# Altium schematic sheet DAC.SchDoc: AI ARTIQ Driver
size 420 x 297 mm; Author: G.Kasprowicz; CompanyName: CTI; Organization: CTI; Address1: CTI; Address2: Nowowiejska 15/19 00-665 Warsaw; Address3: gkasprow@gmail.com; DocumentNumber: 3; Revision: 1.0; SheetNumber: 3; SheetTotal: 11; ModifiedBy: -; CheckedDate: -; Title2: DAC; DivGrp: CTI; ModifiedDate: -; ProjectName: Sensor Box
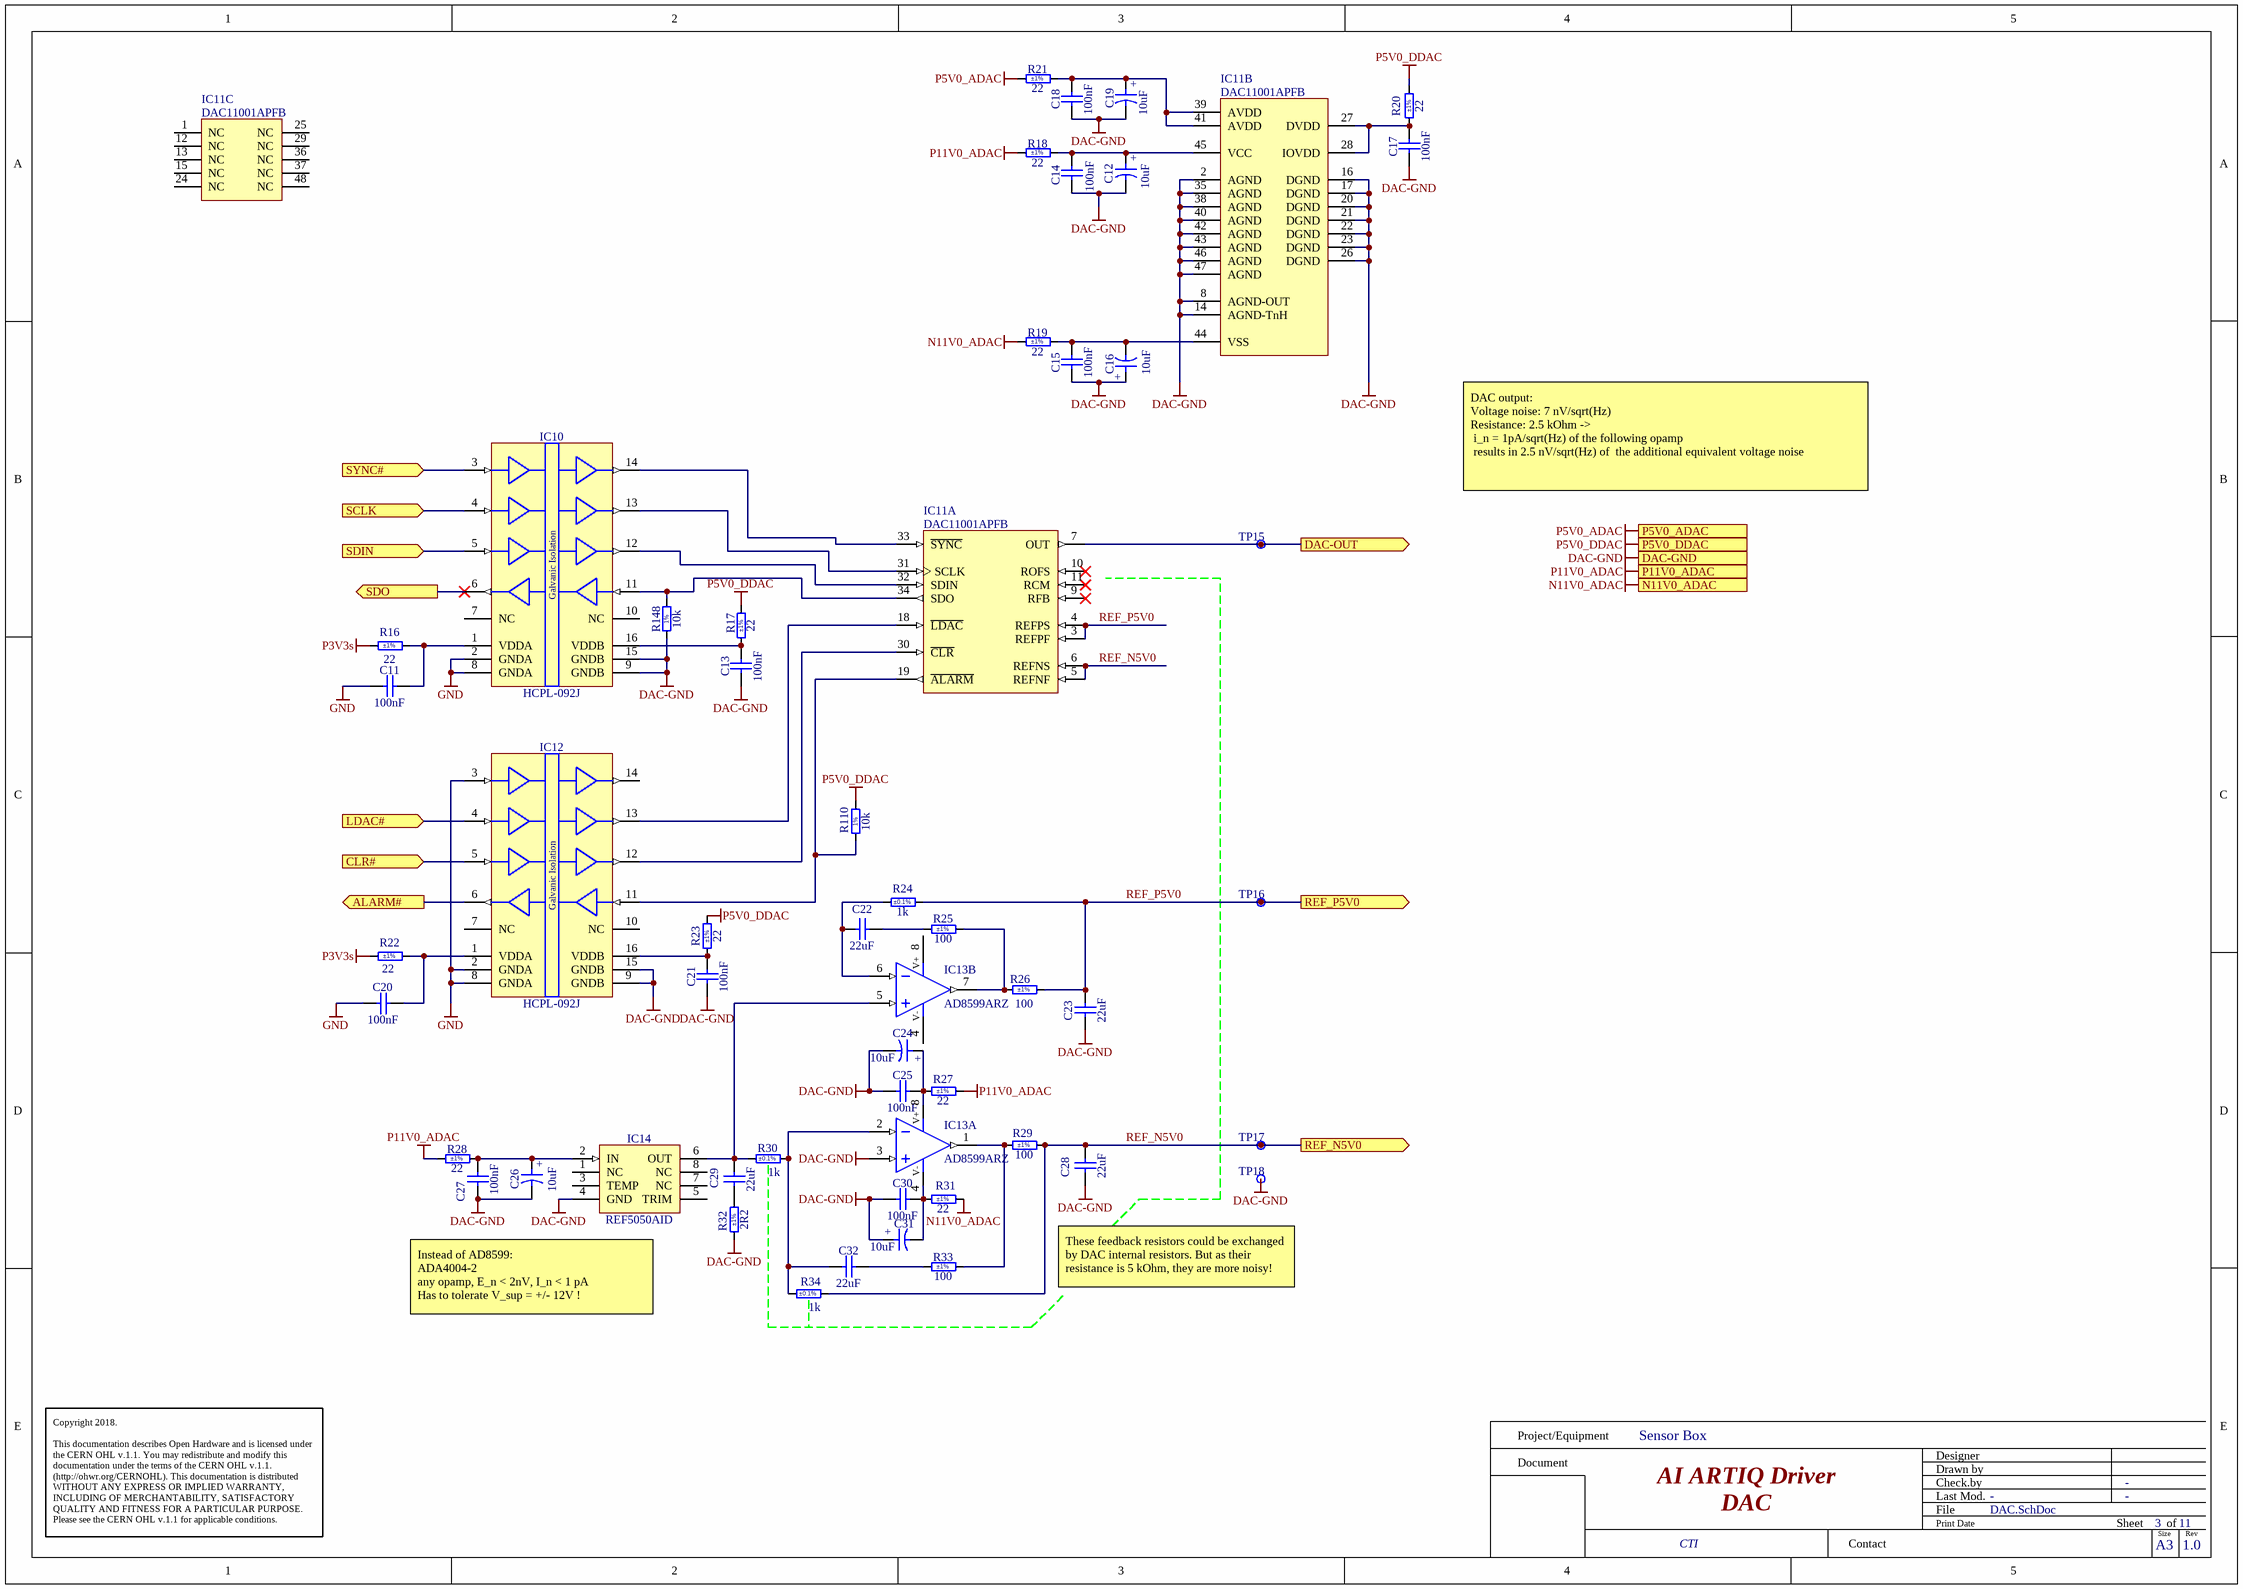
[diagram p0: DAC.SchDoc]

## Parts
C11  100nF  [CAPC1608X87N]
C12  10uF  [CAPMP3528X210N]
C13  100nF  [CAPC1608X87N]
C14  100nF  [CAPC1005X55N]
C15  100nF  [CAPC1005X55N]
C16  10uF  [CAPMP3528X210N]
C17  100nF  [CAPC1005X55N]
C18  100nF  [CAPC1005X55N]
C19  10uF  [CAPMP3528X210N]
C20  100nF  [CAPC1608X87N]
C21  100nF  [CAPC1608X87N]
C22  22uF  [CAPC2012X135N]
C23  22uF  [CAPC2012X135N]
C24  10uF  [CAPMP3528X210N]
C25  100nF  [CAPC1608X87N]
C26  10uF  [CAPMP3528X210N]
C27  100nF  [CAPC1608X87N]
C28  22uF  [CAPC2012X135N]
C29  22uF  [CAPC2012X135N]
C30  100nF  [CAPC1608X87N]
C31  10uF  [CAPMP3528X210N]
C32  22uF  [CAPC2012X135N]
IC10  HCPL-092J  [HCPL-092J]
IC11  DAC11001APFB  [QFP50P900X900X120-48N]  (parts A,B,C of 3)
IC12  HCPL-092J  [HCPL-092J]
IC13  AD8599ARZ  [SOIC127P600X175-8N]  (parts A,B of 2)
IC14  REF5050AID  [SOIC127P600X175-8N]
R16  22  Tolerance: ±1%  [RESC1608X55N]
R17  22  Tolerance: ±1%  [RESC1608X55N]
R18  22  Tolerance: ±1%  [RESC1608X55N]
R19  22  Tolerance: ±1%  [RESC1608X55N]
R20  22  Tolerance: ±1%  [RESC1608X55N]
R21  22  Tolerance: ±1%  [RESC1608X55N]
R22  22  Tolerance: ±1%  [RESC1608X55N]
R23  22  Tolerance: ±1%  [RESC1608X55N]
R24  1k  Tolerance: ±0.1%  [RESC1608X64N]
R25  100  Tolerance: ±1%  [RESC1608X55N]
R26  100  Tolerance: ±1%  [RESC1608X55N]
R27  22  Tolerance: ±1%  [RESC1608X55N]
R28  22  Tolerance: ±1%  [RESC1608X55N]
R29  100  Tolerance: ±1%  [RESC1608X55N]
R30  1k  Tolerance: ±0.1%  [RESC1608X64N]
R31  22  Tolerance: ±1%  [RESC1608X55N]
R32  2R2  Tolerance: ±1%  [RESC1608X55N]
R33  100  Tolerance: ±1%  [RESC1608X55N]
R34  1k  Tolerance: ±0.1%  [RESC1608X64N]
R110  10k  [RESC1608X55N]
R148  10k  [RESC1608X55N]
TP15  Test Point  [TPS127]  (value not drawn)  (no BOM)
TP16  Test Point  [TPS127]  (value not drawn)  (no BOM)
TP17  Test Point  [TPS127]  (value not drawn)  (no BOM)
TP18  Test Point  [TPS127]  (value not drawn)  (no BOM)

## Ports
ALARM# (out), CLR# (in), DAC-GND, DAC-OUT (out), LDAC# (in), N11V0_ADAC, P5V0_ADAC, P5V0_DDAC, P11V0_ADAC, REF_N5V0 (out), REF_P5V0 (out), SCLK (in), SDIN (in), SDO (out), SYNC# (in)

## Nets
DAC-GND: C12.2 C13.1 C14.2 C15.1 C16.1 C17.1 C18.1 C19.2 C21.1 C23.1 C24.2 C25.1 C26.2 C27.1 C28.1 C30.1 C31.1 IC10.9(GNDB) IC10.15(GNDB) IC11.2(AGND) IC11.8(AGND-OUT) IC11.14(AGND-TnH) IC11.16(DGND) IC11.17(DGND) IC11.20(DGND) IC11.21(DGND) IC11.22(DGND) IC11.23(DGND) IC11.26(DGND) IC11.35(AGND) IC11.38(AGND) IC11.40(AGND) IC11.42(AGND) IC11.43(AGND) IC11.46(AGND) IC11.47(AGND) IC12.9(GNDB) IC12.15(GNDB) IC13.3(IN+) IC14.4(GND) R32.1 R148.1 TP18.1 ; port DAC-GND
GND: C11.1 C20.1 IC10.2(GNDA) IC10.8(GNDA) IC12.2(GNDA) IC12.3(IN1) IC12.8(GNDA)
N11V0_ADAC: R19.1 R31.2 ; port N11V0_ADAC
P3V3s: R16.2 R22.2
P5V0_ADAC: R21.1 ; port P5V0_ADAC
P5V0_DDAC: R17.2 R20.2 R23.2 R110.2 ; port P5V0_DDAC
P11V0_ADAC: R18.1 R27.2 R28.1 ; port P11V0_ADAC
ALARM#: IC12.6(IN4) ; port ALARM#
CLR#: IC12.5(IN3) ; port CLR#
DAC-OUT: IC11.7(OUT) TP15.1 ; port DAC-OUT
LDAC#: IC12.4(IN2) ; port LDAC#
REF_N5V0: C28.2 IC11.5(REFNF) IC11.6(REFNS) R29.2 R34.2 TP17.1 ; port REF_N5V0
REF_P5V0: C23.2 IC11.3(REFPF) IC11.4(REFPS) R24.2 R26.2 TP16.1 ; port REF_P5V0
SCLK: IC10.4(IN2) ; port SCLK
SDIN: IC10.5(IN3) ; port SDIN
SDO: IC10.6(IN4) ; port SDO
SYNC#: IC10.3(IN1) ; port SYNC#
NetC11_2: C11.2 IC10.1(VDDA) R16.1
NetC12_1: C12.1 C14.1 IC11.45(VCC) R18.2
NetC13_2: C13.2 IC10.16(VDDB) R17.1
NetC15_2: C15.2 C16.2 IC11.44(VSS) R19.2
NetC17_2: C17.2 IC11.27(DVDD) IC11.28(IOVDD) R20.1
NetC18_2: C18.2 C19.1 IC11.39(AVDD) IC11.41(AVDD) R21.2
NetC20_2: C20.2 IC12.1(VDDA) R22.1
NetC21_2: C21.2 IC12.16(VDDB) R23.1
NetC22_1: C22.1 IC13.6(IN-) R24.1
NetC22_2: C22.2 R25.1
NetC24_1: C24.1 C25.2 IC13.8(V+) R27.1
NetC26_1: C26.1 C27.2 IC14.2(IN) R28.2
NetC29_1: C29.1 R32.2
NetC29_2: C29.2 IC13.5(IN+) IC14.6(OUT) R30.1
NetC30_2: C30.2 C31.2 IC13.4(V-) R31.1
NetC32_1: C32.1 IC13.2(IN-) R30.2 R34.1
NetC32_2: C32.2 R33.1
NetIC10_11: IC10.11(OUT4) IC11.34(SDO) R148.2
NetIC10_12: IC10.12(OUT3) IC11.32(SDIN)
NetIC10_13: IC10.13(OUT2) IC11.31(SCLK)
NetIC10_14: IC10.14(OUT1) IC11.33(~{SYNC})
NetIC11_18: IC11.18(~{LDAC}) IC12.13(OUT2)
NetIC11_19: IC11.19(~{ALARM}) IC12.11(OUT4) R110.1
NetIC11_30: IC11.30(~{CLR}) IC12.12(OUT3)
NetIC13_1: IC13.1(OUT) R29.1 R33.2
NetIC13_7: IC13.7(OUT) R25.2 R26.1

Not connected (* = marked no-connect by the designer): IC10 7(NC) 10(NC); IC11 1(NC) 9(RFB)* 10(ROFS)* 11(RCM)* 12(NC) 13(NC) 15(NC) 24(NC) 25(NC) 29(NC) 36(NC) 37(NC) 48(NC); IC12 7(NC) 10(NC) 14(OUT1); IC14 1(NC) 3(TEMP) 5(TRIM) 7(NC) 8(NC)

## Notes on the sheet
- DAC output:
  Voltage noise: 7 nV/sqrt(Hz)
  Resistance: 2.5 kOhm ->
  i_n = 1pA/sqrt(Hz) of the following opamp
  results in 2.5 nV/sqrt(Hz) of  the additional equivalent voltage noise
- Instead of AD8599:
  ADA4004-2
  any opamp, E_n < 2nV, I_n < 1 pA
  Has to tolerate V_sup = +/- 12V !
- These feedback resistors could be exchanged by DAC internal resistors. But as their resistance is 5 kOhm, they are more noisy!
- Project/Equipment
- Document
- Designer
- Drawn by
- Check.by
- Copyright 2018.
  This documentation describes Open Hardware and is licensed under the CERN OHL v.1.1. You may redistribute and modify this documentation under the terms of the CERN OHL v.1.1. (http://ohwr.org/CERNOHL). This documentation is distributed WITHOUT ANY EXPRESS OR IMPLIED WARRANTY, INCLUDING OF MERCHANTABILITY, SATISFACTORY QUALITY AND FITNESS FOR A PARTICULAR PURPOSE. Please see the CERN OHL v.1.1 for applicable conditions.
- Contact
- File
- Last Mod.
- Print Date
- Sheet
- Size
- A3
- of
- Rev
- (in symbol CTE3528-21_10UF_20V_10%_AVX_TPSB106K020T0500) +
- (in symbol HCPL-092J) Galvanic Isolation
- (in symbol R0603_10K_1%_0.1W_100PPM) 1%

## Library data of the parts
C11 C13 C20 C21 C25 C27 C30 = CC0603_100NF_50V_10%_X7R: Non-polarised capacitor; Part Description: SMD Multilayer Chip Ceramic Capacitor; Manufacturer: GENERIC; Manufacturer1 Part Number: 223858615649; Voltage: 50V; TC: X7R; Tolerance: ±10%; Part Number: CC0603_100NF_50V_10%_X7R; Component Kind: Standard; Component Type: Standard; Pin Count: 2; Value: 100nF; Status: Preferred; Manufacturer Part Number: CC0603_100NF_50V_10%_X7R; Case: 0603; Mounted: Yes; Socket: No; SMD: Yes; Sense: No; Manufacturer1 Example: PHYCOMP; Manufacturer1 ComponentHeight: 0.87mm; HelpURL: \\cern.ch\dfs\Applications\Altium\Datasheets\CC0603_X7R_PHYCOMP.pdf; Author: CERN DEM JLC; CreateDate: 03.12.2007; LatestRevisionDate: 03.12.2007
C12 C16 C19 C24 C26 C31 = CTE3528-21_10UF_20V_10%_AVX_TPSB106K020T0500: Polarised capacitor; Part Description: Low ESR 0R5 Automotive Solid Tantalum Chip Capacitor; Manufacturer: AVX; Voltage: 20V; Tolerance: ±10%; Part Number: CTE3528-21_10UF_20V_10%_AVX_TPSB106K020T0500; Component Kind: Standard; Component Type: Standard; Pin Count: 2; Value: 10uF; Status: Not Recommended; Manufacturer Part Number: TPSB106K020T0500; Case: B; Mounted: Yes; Socket: No; SMD: Yes; Sense: No; ComponentHeight: 2.1mm; HelpURL: \\cern.ch\dfs\Applications\Altium\Datasheets\CTE-LESR_AVX_TPS-AUTO.pdf; Author: CERN DEM JLC; CreateDate: 10.05.2017; LatestRevisionDate: 10.05.2017
C14 C15 C17 C18 = CC0402_100NF_50V_10%_X7R: Non-polarised capacitor; Part Description: SMD Multilayer Chip Ceramic Capacitor; Manufacturer: GENERIC; Manufacturer1 Part Number: GRM155R71H104KE14D; Voltage: 50V; TC: X7R; Tolerance: ±10%; Part Number: CC0402_100NF_50V_10%_X7R; Component Kind: Standard; Component Type: Standard; Pin Count: 2; Value: 100nF; Status: None; Manufacturer Part Number: CC0402_100NF_50V_10%_X7R; Case: 0402; Mounted: Yes; Socket: No; SMD: Yes; Sense: No; Manufacturer1 Example: MURATA; Manufacturer1 ComponentHeight: 0.55mm; HelpURL: \\cern.ch\dfs\Applications\Altium\Datasheets\CC0402_MURATA_GRM155R71H104KE14D.pdf; Author: CERN DEM MR; CreateDate: 30.06.2017; LatestRevisionDate: 30.06.2017
C22 C23 C28 C29 C32 = CC0805_22UF_16V_10%_X5R: Non-polarised capacitor; Part Description: SMD Multilayer Chip Ceramic Capacitor; Manufacturer: GENERIC; Manufacturer1 Part Number: C2012X5R1C226KT; Voltage: 16V; TC: X5R; Tolerance: ±10%; Part Number: CC0805_22UF_16V_10%_X5R; Component Kind: Standard; Component Type: Standard; Pin Count: 2; Value: 22uF; Status: Preferred; Manufacturer Part Number: CC0805_22UF_16V_10%_X5R; Case: 0805; Mounted: Yes; Socket: No; SMD: Yes; Sense: No; Manufacturer1 Example: TDK; Manufacturer1 ComponentHeight: 1.35mm; HelpURL: \\cern.ch\dfs\Applications\Altium\Datasheets\CC0805_X5R_TDK_C.pdf; Author: CERN DEM JLC; CreateDate: 25.10.2012; LatestRevisionDate: 25.10.2012
IC10 IC12 = HCPL-092J: High Speed Digital Isolators Quad, 1/3, Bidirectional; Part Description: 1/3 Channel, Bidirectional, High Speed Digital Isolators Quad; Manufacturer: BROADCOM; PressFit: No; Bonding: No; Part Number: HCPL-092J; Component Kind: Standard; Component Type: Standard; Device: HCPL-092J; Footprint: BROADCOM_HCPL-09X; PackageDescription: SOIC, 1.27mm Pitch; 16 Pin, 9.9mm W X 4.90mm L X 1.8mm H body; Manufacturer Part Number: HCPL-092J; Pin Count: 16; Case: SOIC16; Mounted: Yes; Socket: No; SMD: Yes; Sense: No; ComponentHeight: 1.8mm; Author: CERN DEM HF; HelpURL: \\cern.ch\dfs\Applications\Altium\Datasheets\HCPL-092J.pdf; CreateDate: 23.03.2022; LatestRevisionDate: 23.03.2022
IC11 = DAC11001APFB: 20 Bit, Low-Noise, Ultra-Low Harmonic Distortion, FastSettling, High-Voltage Output, Digital-to-Analog Converter; Manufacturer: TEXAS INSTRUMENTS; PressFit: No; Bonding: No; Part Number: DAC11001APFB; Component Kind: Standard; Component Type: Standard; Device: DAC11001APFB; PackageDescription: QFP, 0.50mm Pitch, Square, 48 Pin, 7.00mm L X 7.00mm W X 1.20mm H body, IPC Medium Density; Part Description: 20 Bit, Low-Noise, Ultra-Low Harmonic Distortion, FastSettling, High-Voltage Output, Digital-to-Analog Converter; Manufacturer Part Number: DAC11001APFB; Pin Count: 48; Case: QFP48; Mounted: Yes; Socket: No; SMD: Yes; Sense: No; ComponentHeight: 1.2mm; Author: CERN DEM HF; HelpURL: \\cern.ch\dfs\Applications\Altium\Datasheets\DAC11001APFB.pdf; CreateDate: 17.05.2022; LatestRevisionDate: 17.05.2022
IC13 = AD8599ARZ: Dual Operational Amplifier; Part Description: Dual, Ultralow Distorsion, Ultralow Noise Operational Amplifier; Manufacturer: ANALOG DEVICES; PressFit: No; Bonding: No; Part Number: AD8599ARZ; Component Kind: Standard; Component Type: Standard; Device: AD8599ARZ; PackageDescription: SOIC, 1.27mm Pitch; 8 Pin, 4.00mm W X 5.00mm L X 1.75mm H body, IPC Medium Density; Manufacturer Part Number: AD8599AR; Pin Count: 8; Case: SOIC8; Mounted: Yes; Socket: No; SMD: Yes; Sense: No; ComponentHeight: 1.75mm; Author: CERN DEM BC; HelpURL: \\cern.ch\dfs\Applications\Altium\Datasheets\AD8599ARZ.pdf; CreateDate: 01.12.2020; LatestRevisionDate: 29.03.2022
IC14 = REF5050AID: Low-Noise, Very Low Drift, Precision Voltage Reference; Part Description: 5V, Low-Noise, Very Low Drift, Precision Voltage Reference; Manufacturer: TEXAS INSTRUMENTS; PressFit: No; Bonding: No; Part Number: REF5050AID; Component Kind: Standard; Component Type: Standard; Device: REF5050AID; PackageDescription: SOIC 8, Pitch 1.27mm, Body 4x5mm, IPC Medium Density; Manufacturer Part Number: REF5050AID; Pin Count: 8; Case: SOIC8; Mounted: Yes; Socket: No; SMD: Yes; Sense: No; ComponentHeight: 1.75mm; HelpURL: \\cern.ch\dfs\Applications\Altium\Datasheets\REF5045AID.pdf; Author: CERN DEM HF; CreateDate: 18.05.2022; LatestRevisionDate: 18.05.2022
R16-R23 R27 R28 R31 = R0603_22R_1%_0.1W_100PPM: Resistor - 1%; Part Description: General Purpose Thick Film Chip Resistor; Manufacturer: GENERIC; Manufacturer1 Part Number: NRC06F22R0TRF; Power: 0.1W; TC: ±100ppm/°C; PressFit: No; Part Number: R0603_22R_1%_0.1W_100PPM; Component Kind: Standard; Component Type: Standard; Pin Count: 2; Value: 22; Status: Preferred; Manufacturer Part Number: R0603_22R_1%_0.1W_100PPM; Case: 0603; Mounted: Yes; Sense: No; Socket: No; SMD: Yes; Manufacturer1 Example: NIC COMPONENT; Manufacturer1 ComponentHeight: 0.55mm; HelpURL: \\cern.ch\dfs\Applications\Altium\Datasheets\R0603_NIC_NRC.pdf; Author: CERN DEM JLC; CreateDate: 03.12.2007; LatestRevisionDate: 13.03.2008
R24 R30 R34 = R0603_1K_0.1%_0.1W_25PPM: Resistor - 0.1%; Part Description: Thin Film Chip Resistor; Manufacturer: GENERIC; Manufacturer1 Part Number: ERA3AEB102V; Power: 0.1W; TC: ±25ppm/°C; PressFit: No; Part Number: R0603_1K_0.1%_0.1W_25PPM; Component Kind: Standard; Component Type: Standard; Pin Count: 2; Value: 1k; Status: Not Recommended; Manufacturer Part Number: R0603_1K_0.1%_0.1W_25PPM; Case: 0603; Mounted: Yes; Sense: No; Socket: No; SMD: Yes; Manufacturer1 Example: PANASONIC; Manufacturer1 ComponentHeight: 0.55mm; HelpURL: \\cern.ch\dfs\Applications\Altium\Datasheets\R0603_PANASONIC_ERA.pdf; Author: CERN DEM JLC; CreateDate: 11.01.2017; LatestRevisionDate: 11.01.2017
R25 R26 R29 R33 = R0603_100R_1%_0.1W_100PPM: Resistor - 1%; Part Description: General Purpose Thick Film Chip Resistor; Manufacturer: GENERIC; Manufacturer1 Part Number: NRC06F4700TRF; Power: 0.1W; TC: ±100ppm/°C; PressFit: No; Part Number: R0603_100R_1%_0.1W_100PPM; Component Kind: Standard; Component Type: Standard; Pin Count: 2; Value: 100; Status: Preferred; Manufacturer Part Number: R0603_100R_1%_0.1W_100PPM; Case: 0603; Mounted: Yes; Sense: No; Socket: No; SMD: Yes; Manufacturer1 Example: NIC COMPONENT; Manufacturer1 ComponentHeight: 0.55mm; HelpURL: \\cern.ch\dfs\Applications\Altium\Datasheets\R0603_NIC_NRC.pdf; Author: CERN DEM JLC; CreateDate: 03.12.2007; LatestRevisionDate: 13.03.2008
R32 = R0603_2R2_1%_0.1W_200PPM: Resistor - 1%; Part Description: General Purpose Thick Film Chip Resistor; Manufacturer: GENERIC; Manufacturer1 Part Number: 232270462208L or RC0603FR-072R2L; Power: 0.1W; TC: ±200ppm/°C; PressFit: No; Part Number: R0603_2R2_1%_0.1W_200PPM; Component Kind: Standard; Component Type: Standard; Pin Count: 2; Value: 2R2; Status: Preferred; Manufacturer Part Number: R0603_2R2_1%_0.1W_200PPM; Case: 0603; Mounted: Yes; Sense: No; Socket: No; SMD: Yes; Manufacturer1 Example: YAGEO PHYCOMP; Manufacturer1 ComponentHeight: 0.65mm; HelpURL: \\cern.ch\dfs\Applications\Altium\Datasheets\R0603_Tyco_RN73.pdf; Author: CERN DEM JLC; CreateDate: 03.12.2007; LatestRevisionDate: 17.10.2012
R110 R148 = R0603_10K_1%_0.1W_100PPM: Resistor - 1%; Part Description: General Purpose Thick Film Chip Resistor; Manufacturer: GENERIC; Manufacturer1 Part Number: NRC06F1002TRF; Power: 0.1W; TC: ±100ppm/°C; PressFit: No; Part Number: R0603_10K_1%_0.1W_100PPM; Component Kind: Standard; Component Type: Standard; Pin Count: 2; Value: 10k; Status: Preferred; Tolerance: ±1%; Manufacturer Part Number: R0603_10K_1%_0.1W_100PPM; Case: 0603; Mounted: Yes; Sense: No; Socket: No; SMD: Yes; Manufacturer1 Example: NIC COMPONENT; Manufacturer1 ComponentHeight: 0.55mm; HelpURL: \\cern.ch\dfs\Applications\Altium\Datasheets\R0603_NIC_NRC.pdf; Author: CERN DEM JLC; CreateDate: 03.12.2007; LatestRevisionDate: 13.03.2008
TP15-TP18 = SMD_PAD_1.27X1.27MM: Part Description: 1.27mm x 1.27mm PCB Copper Area (SMD Test Point); Mounted: No; Part Number: SMD_PAD_1.27X1.27MM; Component Type: Standard (No BOM); Pin Count: 1; Family: Test Point; Socket: No; SMD: No; Sense: No; Status: None; ComponentHeight: 0mm; HelpURL: Undefined; Author: CERN DEM JLC; CreateDate: 12.01.2008; LatestRevisionDate: 12.01.2008; PackageDescription: 1.27mm x 1.27mm PCB Copper Area (SMD Test Point)